# EasyEDA Pro project SCH.epro

# Schematic 【蓝桥杯练习题二】第十三届蓝桥杯EDA赛模拟题
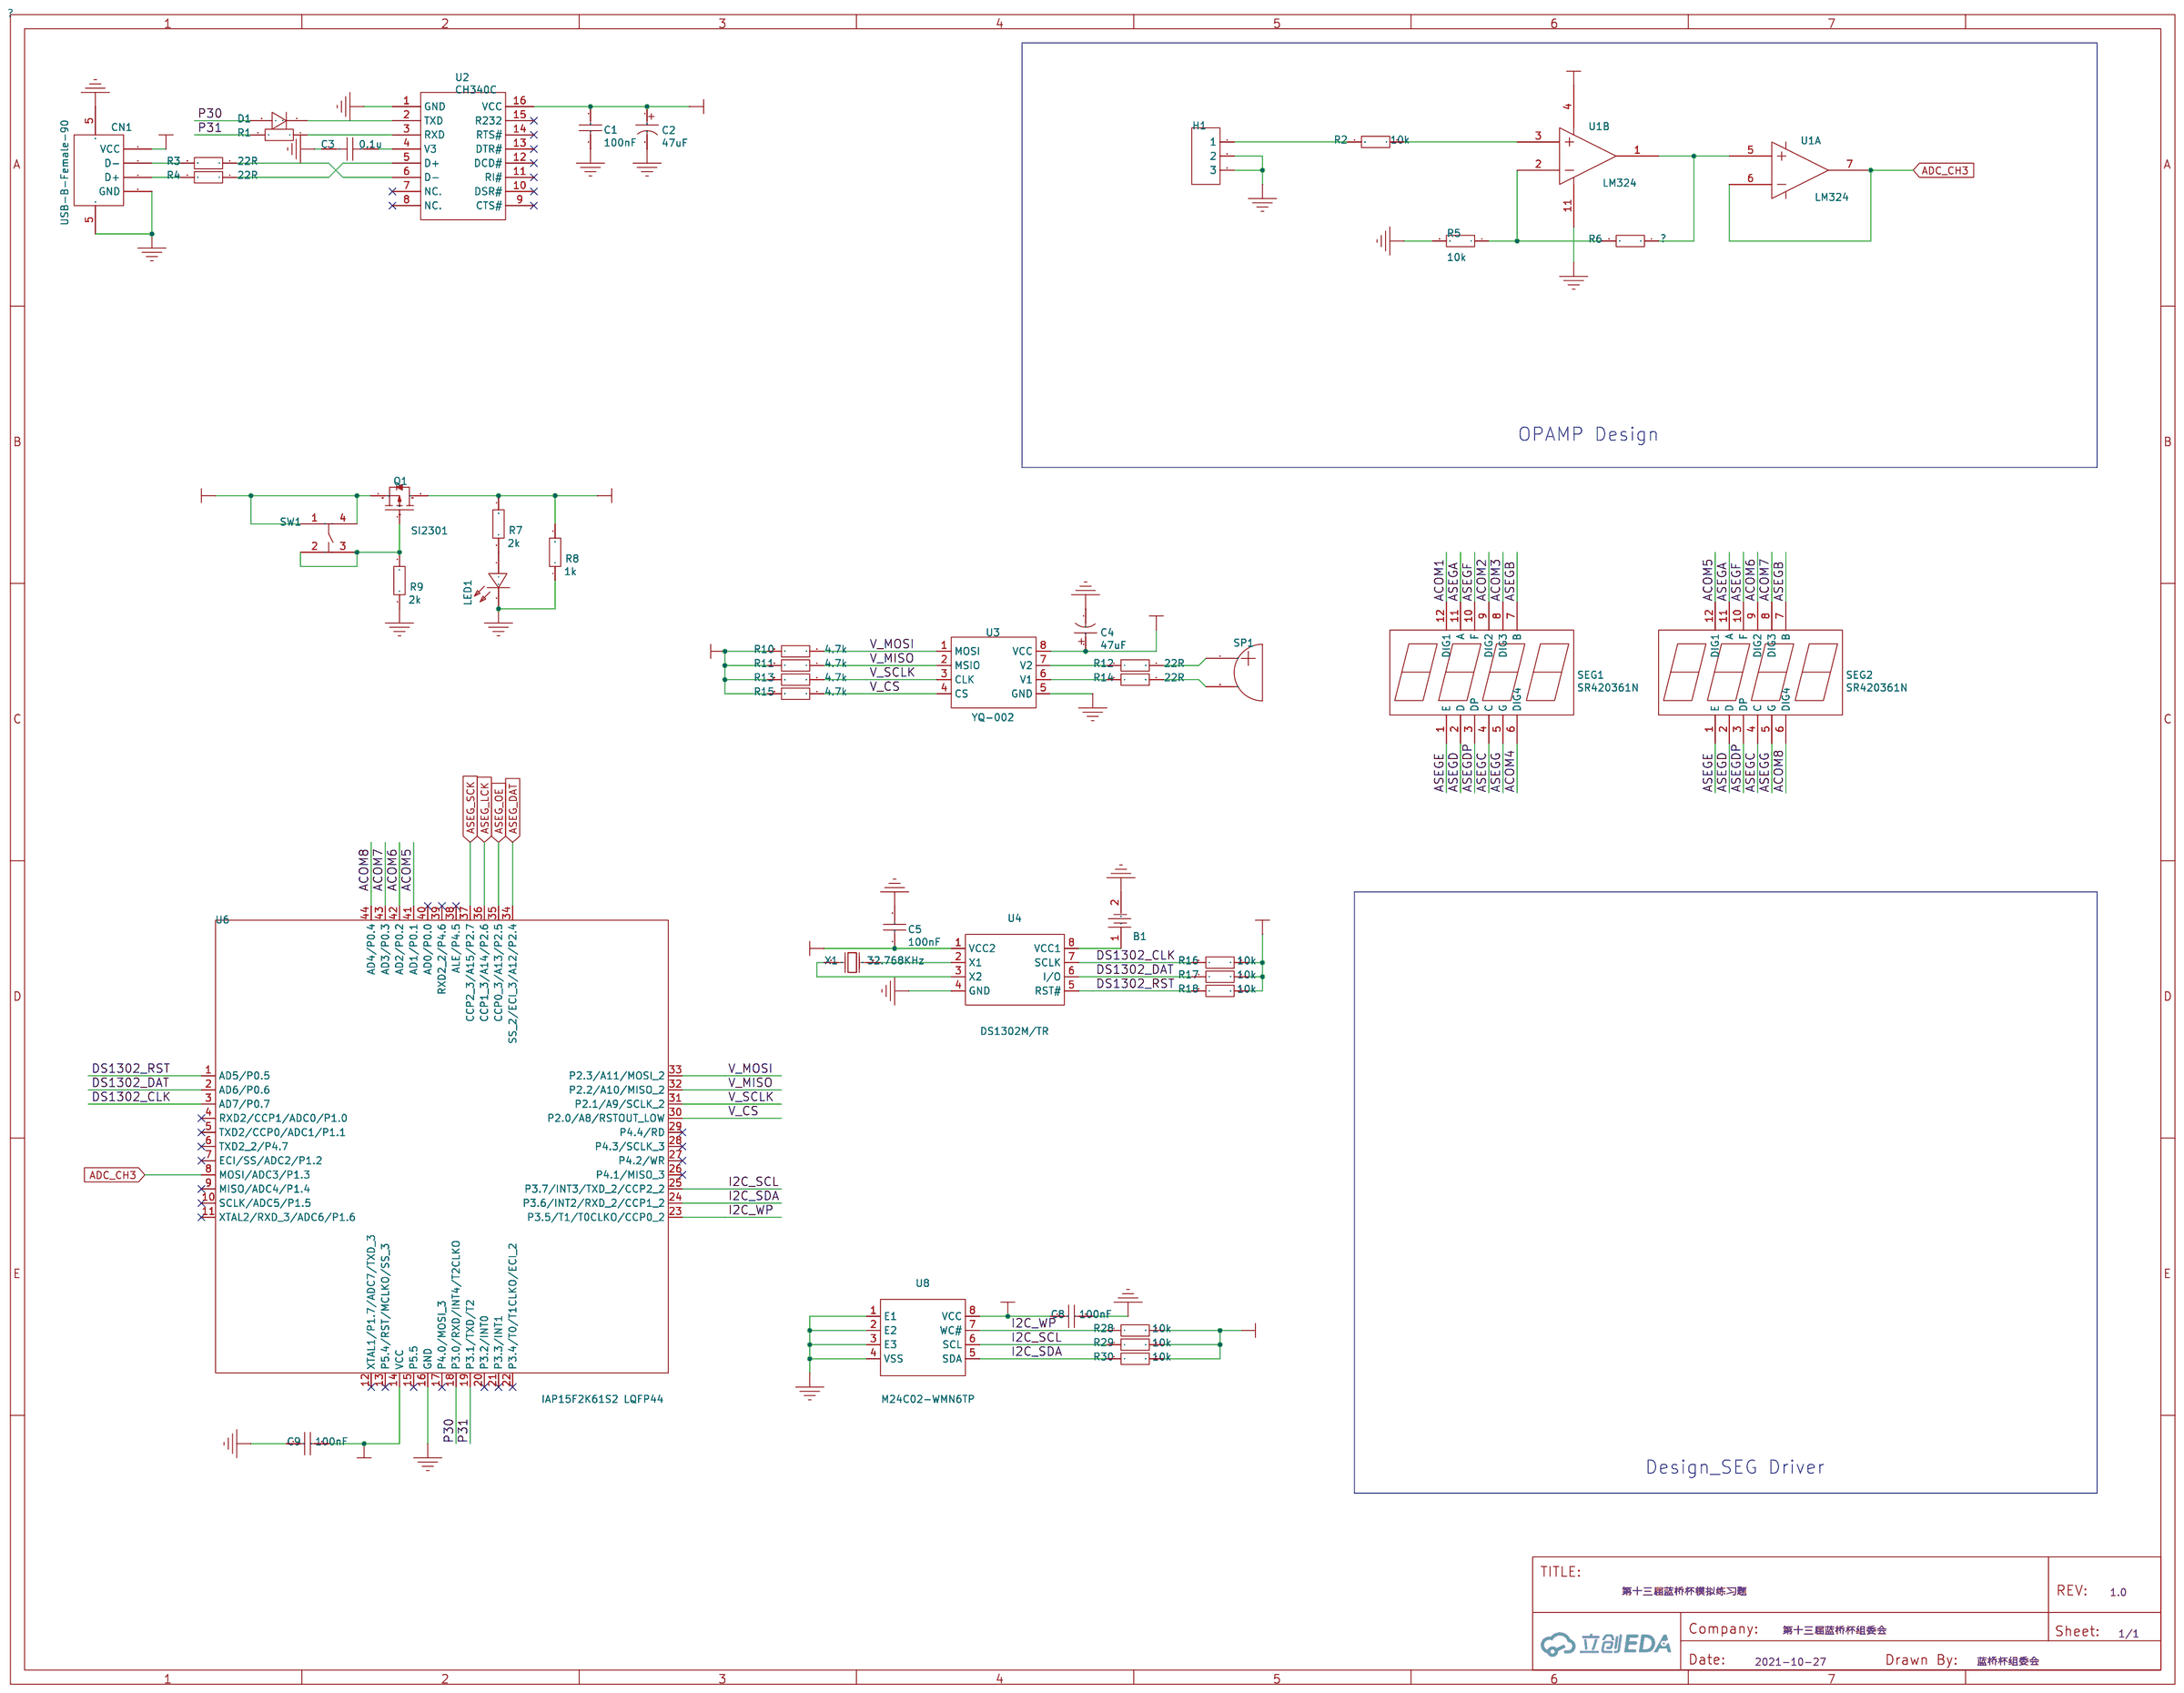
[diagram p0: schematic sheet]

## Parts
B1  CR1220-2
C1  100nF
C2  47uF
C3  0.1u
C4  47uF
C5  100nF
C8  100nF
C9  100nF
CN1  USB-B-Female-90
D1  KLL4148
H1  HDR-F-2.54_1x3
LED1  17-21URC/TR8
Q1  SI2301
R1  1k
R2  10k
R3  22R
R4  22R
R5  10k
R6  ？
R7  2k
R8  1k
R9  2k
R10  4.7k
R11  4.7k
R12  22R
R13  4.7k
R14  22R
R15  4.7k
R16  10k
R17  10k
R18  10k
R28  10k
R29  10k
R30  10k
SEG1  SR420361N
SEG2  SR420361N
SP1  BUZZER
SW1  TS-1159UB-B-D-BL
U1  LM324  (sections 1,2)
U2  CH340C
U3  YQ-002
U4  DS1302M/TR
U6  IAP15F2K61S2 LQFP44
U8  M24C02-WMN6TP
X1  32.768KHz

## Library data of the parts
B1 = CR1220-2: Supplier: LCSC; Manufacturer: Q&J; image: //image.lceda.cn/szlcsc/C70381.jpg; Supplier Part: C70381
C1 C5 C8 C9 = 0805F104M500NT: Supplier: LCSC; Manufacturer: FH; Supplier Part: C28378
C2 C4 = VES470M1HTR-0607: Supplier: LCSC; Manufacturer: LELON; Supplier Part: C108053; JLCPCB Part Class: Extended Part
C3 = 0.1u
CN1 = USB-BF90: Supplier: LCSC; Manufacturer: ValuePro; image: //image.lceda.cn/szlcsc/C46392.jpg; Supplier Part: C46392
D1 = KLL4148: Supplier: LCSC; Supplier Part: C369941; Manufacturer: KEXIN
H1 = HDR-F-2.54_1x3: Supplier Part: C146690; Supplier: LCSC
LED1 = 17-21URC/TR8: Supplier: LCSC; Supplier Part: C264414; Manufacturer: Everlight Elec
Q1 = SI2301: Supplier: LCSC; Manufacturer: Hottech; Supplier Part: C181086; JLCPCB Part Class: Extend
R1-R18 R28-R30 = 080500J0104T5E: Supplier: LCSC; Manufacturer: UniOhm; Supplier Part: C149503
SEG1 SEG2 = SR420361N: Supplier: LCSC; Supplier Part: C98926; Manufacturer: Wuxi ARK Tech Elec; JLCPCB Part Class: Extended Part
SP1 = BUZZER
SW1 = TS-1159UB-B-D-BL: Supplier: LCSC; Supplier Part: C692480; Manufacturer: XKB Connectivity
U1 = LM324
U2 = CH340C: Supplier: LCSC; Manufacturer: WCH; Supplier Part: C84681; JLCPCB Part Class: Extend
U3 = YQ-002
U4 = DS1302M/TR: Supplier: LCSC; Supplier Part: C434511; Manufacturer: HGSEMI
U6 = IAP15F2K61S2 LQFP44: Supplier: LCSC; Manufacturer: STC; Supplier Part: C47451; JLCPCB Part Class: Extend
U8 = M24C02-WMN6TP: Supplier: LCSC; Manufacturer: STMicroelectronics; image: //image.lceda.cn/szlcsc/C7562.jpg; Supplier Part: C7562; JLCPCB Part Class: Basic
X1 = 6K832768F12UB: Supplier: LCSC; Supplier Part: C252404; Manufacturer: SHENZHEN CRYSTAL TECH

## Nets
GND: B1.2 C1.1 C2.2 C3.1 C4.2 C5.2 C8.2 C9.1 CN1.4(GND) CN1.5(SH2) H1.2 H1.3 LED1.2(K) R5.2 R8.1 R9.1 U1.11 U2.1(GND) U3.5(GND) U4.4(GND) U6.16(GND) U8.1(E1) U8.2(E2) U8.3(E3) U8.4(VSS)
VDD_NODE_A: C4.1 C5.1 C8.1 C9.2 Q1.3(D) R7.2 R8.2 R10.2 R11.2 R13.2 R15.2 R16.2 R17.2 R18.2 R28.2 R29.2 R30.2 U1.4 U3.8(VCC) U4.1(VCC2) U6.14(VCC) U8.8(VCC)
ACOM1: SEG1.12(DIG1)
ACOM2: SEG1.9(DIG2)
ACOM3: SEG1.8(DIG3)
ACOM4: SEG1.6(DIG4)
ACOM5: SEG2.12(DIG1) U6.41(AD1/P0.1)
ACOM6: SEG2.9(DIG2) U6.42(AD2/P0.2)
ACOM7: SEG2.8(DIG3) U6.43(AD3/P0.3)
ACOM8: SEG2.6(DIG4) U6.44(AD4/P0.4)
ADC_CH3: U1.6 U1.7 U6.8(MOSI/ADC3/P1.3)
ASEG_DAT: U6.34(SS_2/ECI_3/A12/P2.4)
ASEG_LCK: U6.36(CCP1_3/A14/P2.6)
ASEG_OE: U6.35(CCP0_3/A13/P2.5)
ASEG_SCK: U6.37(CCP2_3/A15/P2.7)
ASEGA: SEG1.11(A) SEG2.11(A)
ASEGB: SEG1.7(B) SEG2.7(B)
ASEGC: SEG1.4(C) SEG2.4(C)
ASEGD: SEG1.2(D) SEG2.2(D)
ASEGDP: SEG1.3(DP) SEG2.3(DP)
ASEGE: SEG1.1(E) SEG2.1(E)
ASEGF: SEG1.10(F) SEG2.10(F)
ASEGG: SEG1.5(G) SEG2.5(G)
DS1302_CLK: R16.1 U4.7(SCLK) U6.3(AD7/P0.7)
DS1302_DAT: R17.1 U4.6(I/O) U6.2(AD6/P0.6)
DS1302_RST: R18.1 U4.5(RST#) U6.1(AD5/P0.5)
I2C_SCL: R29.1 U6.25(P3.7/INT3/TXD_2/CCP2_2) U8.6(SCL)
I2C_SDA: R30.1 U6.24(P3.6/INT2/RXD_2/CCP1_2) U8.5(SDA)
I2C_WP: R28.1 U6.23(P3.5/T1/T0CLKO/CCP0_2) U8.7(WC#)
P30: D1.2(A) U6.18(P3.0/RXD/INT4/T2CLKO)
P31: R1.2 U6.19(P3.1/TXD/T2)
V_CS: R15.1 U3.4(CS) U6.30(P2.0/A8/RSTOUT_LOW)
V_MISO: R11.1 U3.2(MSIO) U6.32(P2.2/A10/MISO_2)
V_MOSI: R10.1 U3.1(MOSI) U6.33(P2.3/A11/MOSI_2)
V_SCLK: R13.1 U3.3(CLK) U6.31(P2.1/A9/SCLK_2)
VUSB: C1.2 C2.1 CN1.1(VCC) Q1.2(S) SW1.1 SW1.4(2) U2.16(VCC)
Net-(B1-1): B1.1 U4.8(VCC1)
Net-(C3-2): C3.2 U2.4(V3)
Net-(CN1-2): CN1.2(D-) R3.2
Net-(CN1-3): CN1.3(D+) R4.2
Net-(D1-1): D1.1(C) U2.2(TXD)
Net-(H1-1): H1.1 R2.2
Net-(LED1-1): LED1.1(A) R7.1
Net-(Q1-1): Q1.1(G) R9.2 SW1.2(4) SW1.3
Net-(R1-1): R1.1 U2.3(RXD)
Net-(R2-1): R2.1 U1.3
Net-(R3-1): R3.1 U2.6(D-)
Net-(R4-1): R4.1 U2.5(D+)
Net-(R5-1): R5.1 R6.2 U1.2
Net-(R6-1): R6.1 U1.1 U1.5
Net-(R12-1): R12.1 U3.7(V2)
Net-(R12-2): R12.2 SP1.1
Net-(R14-1): R14.1 U3.6(V1)
Net-(R14-2): R14.2 SP1.2
Net-(U4-2): U4.2(X1) X1.2(OSC2)
Net-(U4-3): U4.3(X2) X1.1(OSC1)

Not connected (* = marked no-connect by the designer): U2 7(NC.)* 8(NC.)* 9(CTS#)* 10(DSR#)* 11(RI#)* 12(DCD#)* 13(DTR#)* 14(RTS#)* 15(R232)*; U6 4(RXD2/CCP1/ADC0/P1.0)* 5(TXD2/CCP0/ADC1/P1.1)* 6(TXD2_2/P4.7)* 7(ECI/SS/ADC2/P1.2)* 9(MISO/ADC4/P1.4)* 10(SCLK/ADC5/P1.5)* 11(XTAL2/RXD_3/ADC6/P1.6)* 12(XTAL1/P1.7/ADC7/TXD_3)* 13(P5.4/RST/MCLKO/SS_3)* 15(P5.5)* 17(P4.0/MOSI_3)* 20(P3.2/INT0)* 21(P3.3/INT1)* 22(P3.4/T0/T1CLKO/ECI_2)* 26(P4.1/MISO_3)* 27(P4.2/WR)* 28(P4.3/SCLK_3)* 29(P4.4/RD)* 38(ALE/P4.5)* 39(RXD2_2/P4.6)* 40(AD0/P0.0)*

## Notes on the sheet
- OPAMP Design
- Design_SEG Driver
